# EAGLE design agouti (EAGLE 6.3)
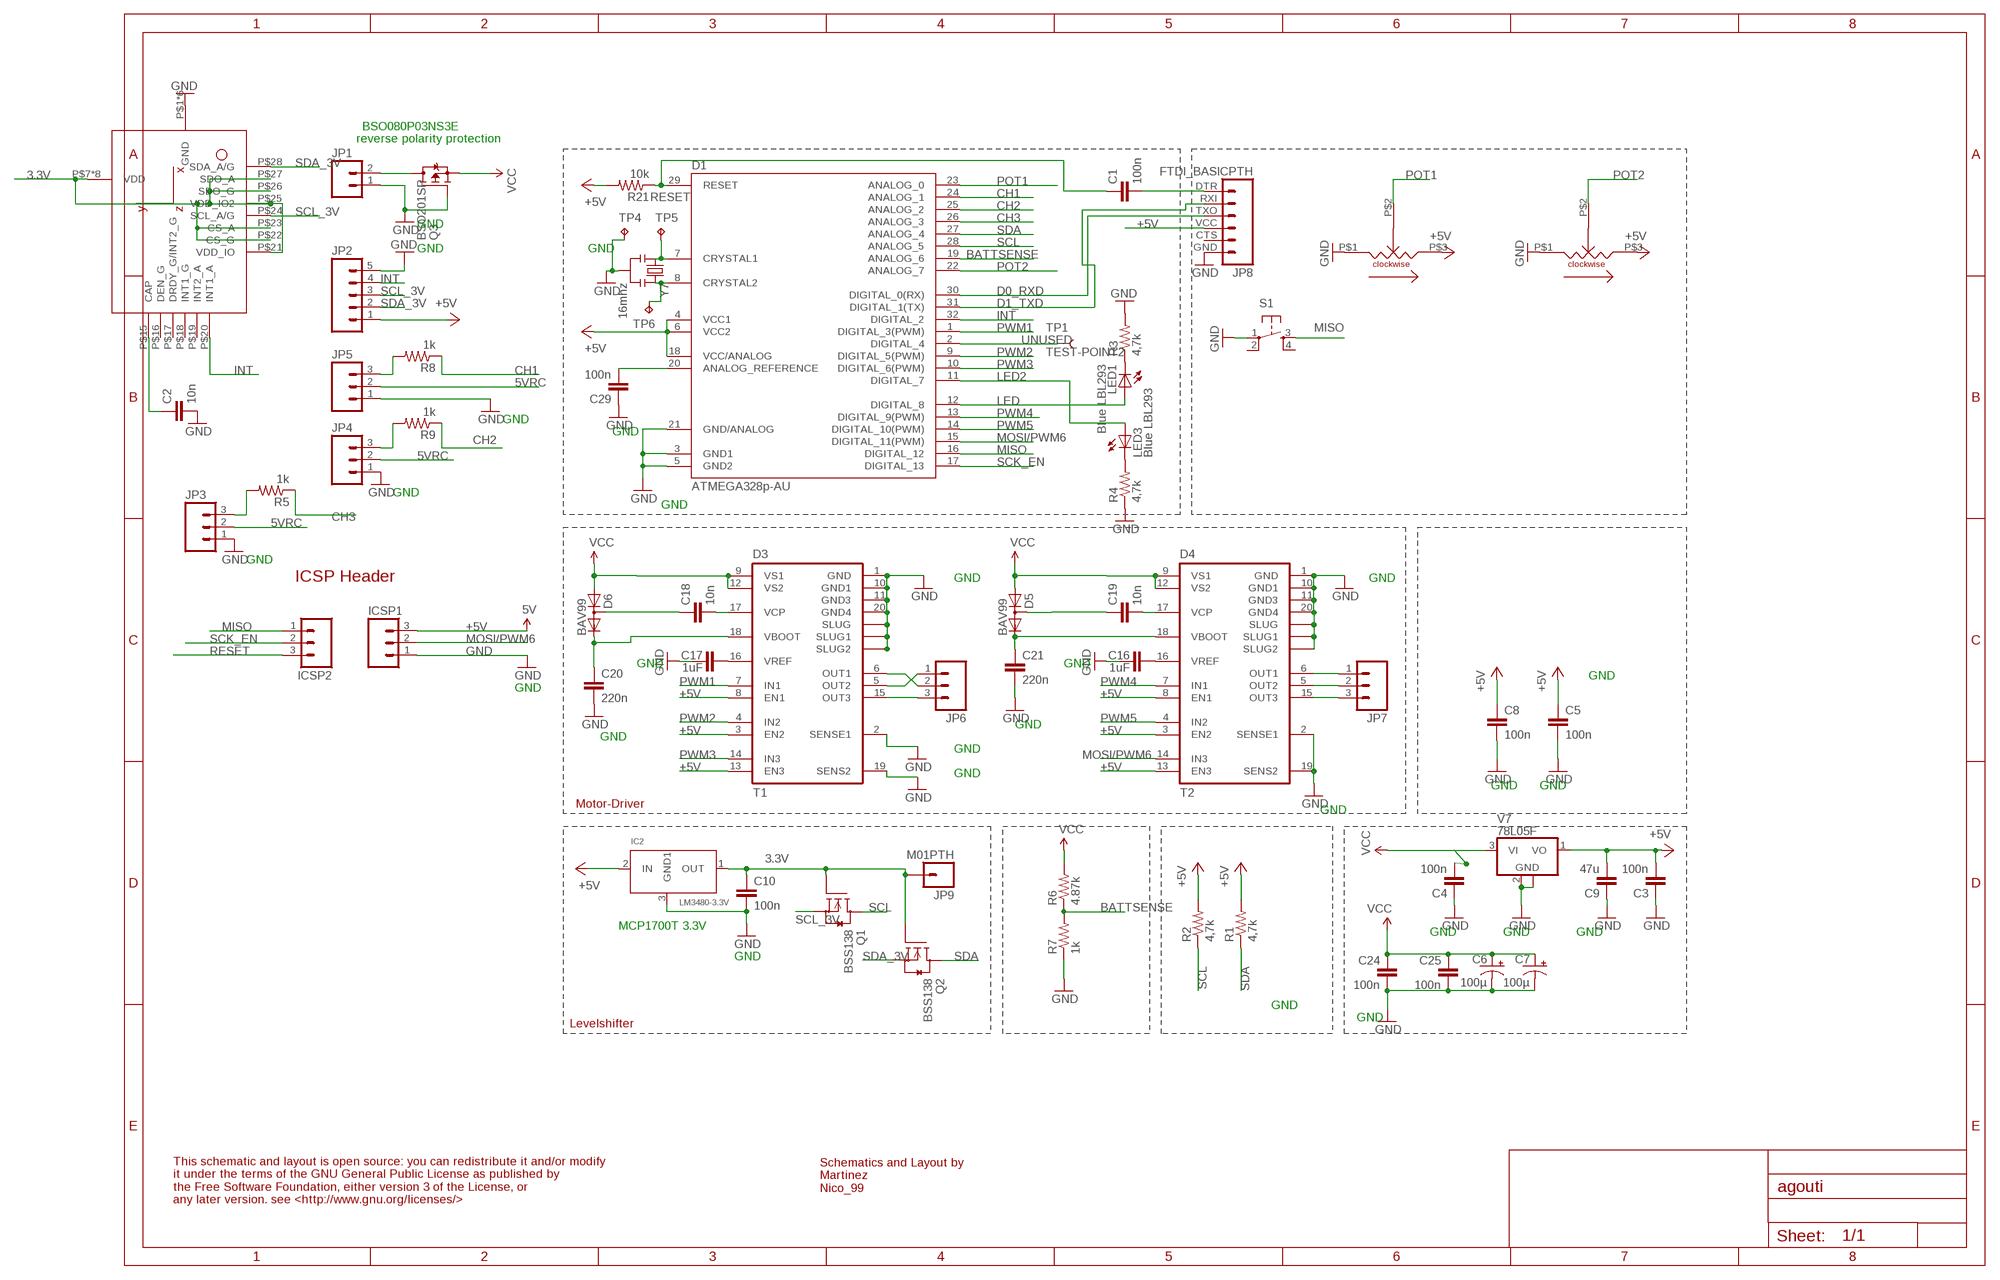
[diagram p0: schematic, sheet 1]

## Parts
C1  100n  CAP0805  [0805]
C2  10n  CAP0805  [0805]
C3  100n  CAP0805  [0805]
C4  100n  CAP0805  [0805]
C5  100n  CAP0805  [0805]
C6  100µ  CAP_POLD  [PANASONIC_D]
C7  100µ  CAP_POLD  [PANASONIC_D]
C8  100n  CAP0805  [0805]
C9  47u  C-EUC1210  [C1210]
C10  100n  CAP0805  [0805]
C16  1uF  CAP0805  [0805]
C17  1uF  CAP0805  [0805]
C18  10n  CAP0805  [0805]
C19  10n  CAP0805  [0805]
C20  220n  CAP0805  [0805]
C21  220n  CAP0805  [0805]
C24  100n  CAP0805  [0805]
C25  100n  CAP0805  [0805]
C29  100n  CAP0805  [0805]
D1  ATMEGA328p-AU  ATMEGA168-AU  [TQFP32-08]
D3  T1  L6234  [SO20POWER2]
D4  T2  L6234  [SO20POWER2]
D5  BAV99  BAV199  [SOT23]
D6  BAV99  BAV199  [SOT23]
IC2  LM3480-3.3V  VREG_MULTI2  [SOT23]
ICSP1  M03PTH  [1X03]
ICSP2  M03PTH  [1X03]
JP1  M02PTH  [1X02]
JP2  M05PTH  [1X05]
JP3  M03PTH  [1X03]
JP4  M03PTH  [1X03]
JP5  M03PTH  [1X03]
JP6  M03PTH  [1X03]
JP7  M03PTH  [1X03]
JP8  FTDI_BASICPTH  [FTDI_BASIC]
JP9  M01PTH  [1X01]
LED1  Blue LBL293  LEDCHIP-LED0603  [CHIP-LED0603]
LED3  Blue LBL293  LEDCHIP-LED0603  [CHIP-LED0603]
Q1  BSS138  [SOT23]
Q2  BSS138  [SOT23]
Q3  BSO201SP  [SO-8]
R1  4,7k  RESISTOR0805-RES  [0805]
R2  4,7k  RESISTOR0805-RES  [0805]
R3  4,7k  RESISTOR0805-RES  [0805]
R4  4,7k  RESISTOR0805-RES  [0805]
R5  1k  RESISTOR0805-RES  [0805]
R6  4.87k  RESISTOR0805-RES  [0805]
R7  1k  RESISTOR0805-RES  [0805]
R8  1k  RESISTOR0805-RES  [0805]
R9  1k  RESISTOR0805-RES  [0805]
R21  10k  RESISTOR0805-RES  [0805]
S1  TAC_SWITCHSMD  [TACTILE_SWITCH_SMD]
TP1  TEST-POINT2  [PAD.02X.02]
TP4  TPTP06SQ  [TP06SQ]
TP5  TPTP06SQ  [TP06SQ]
TP6  TPTP06SQ  [TP06SQ]
U$3  TRIMMERPOT  [BOURNES_3361P]
U$5  TRIMMERPOT  [BOURNES_3361P]
U$6  LSM330  [LGA-28]
V7  78L05F  [SOT89]
Y7  16mhz  RESONATORSMD  [RESONATOR-SMD]

## Nets
3.3V: C10.1 IC2.1(OUT) JP9.1 Q1.1(G) Q2.1(G) U$6.P$7(VDD) U$6.P$8(VDD) U$6.P$9(VDD) U$6.P$10(VDD) U$6.P$11(VDD) U$6.P$12(VDD) U$6.P$13(VDD) U$6.P$14(VDD) U$6.P$21(VDD_IO) U$6.P$22(CS_G) U$6.P$23(CS_A) U$6.P$25(VDD_IO2) U$6.P$26(SDO_G) U$6.P$27(SDO_A)
5VRC: JP3.2 JP4.2 JP5.2
+5V: C3.2 C5.1 C8.1 C9.2 D1.4(VCC1) D1.6(VCC2) D1.18(VCC/ANALOG) D3.3(EN2) D3.8(EN1) D3.13(EN3) D4.3(EN2) D4.8(EN1) D4.13(EN3) IC2.2(IN) ICSP1.3 JP2.1 JP8.VCC R1.2 R2.2 R21.2 U$3.P$3 U$5.P$3 V7.1(VO) ; supply symbol labelled 5V
BATTSENSE: D1.19(ANALOG_6) R6.1 R7.2
CH1: D1.24(ANALOG_1) R8.1
CH2: D1.25(ANALOG_2) R9.1
CH3: D1.26(ANALOG_3) R5.1
D0_RXD: D1.30(DIGITAL_0(RX)) JP8.TXO
D1_TXD: D1.31(DIGITAL_1(TX)) JP8.RXI
GND: C2.2 C3.1 C4.1 C5.2 C6.- C7.- C8.2 C9.1 C10.2 C16.1 C17.1 C20.2 C21.2 C24.2 C25.2 C29.1 D1.3(GND1) D1.5(GND2) D1.21(GND/ANALOG) D3.1(GND) D3.2(SENSE1) D3.10(GND1) D3.11(GND3) D3.19(SENS2) D3.20(GND4) D3.SLUG1(SLUG2) D3.SLUG2(SLUG) D3.SLUG(SLUG1) D4.1(GND) D4.2(SENSE1) D4.10(GND1) D4.11(GND3) D4.19(SENS2) D4.20(GND4) D4.SLUG1(SLUG2) D4.SLUG2(SLUG) D4.SLUG(SLUG1) IC2.3(GND1) ICSP1.1 JP1.1 JP2.5 JP3.1 JP4.1 JP5.1 JP8.GND Q3.4(G) R3.2 R4.1 R7.1 S1.1 TP4.TP U$3.P$1 U$5.P$1 U$6.P$1(GND) U$6.P$2(GND) U$6.P$3(GND) U$6.P$4(GND) U$6.P$5(GND) U$6.P$6(GND) V7.2(GND) V7.2@1(GND) Y7.2
INT: D1.32(DIGITAL_2) JP2.4 U$6.P$20(INT1_A)
LED: D1.12(DIGITAL_8) LED1.A
LED2: D1.11(DIGITAL_7) LED3.A
MISO: D1.16(DIGITAL_12) ICSP2.1 S1.3
MOSI/PWM6: D1.15(DIGITAL_11(PWM)) D4.14(IN3) ICSP1.2
N$1: LED1.C R3.1
N$2: LED3.C R4.2
N$3: JP1.2 Q3.5(D) Q3.6(D) Q3.7(D) Q3.8(D)
N$4: JP3.3 R5.2
N$5: JP5.3 R8.2
N$6: JP4.3 R9.2
N$7: C16.2 D4.16(VREF)
N$8: C17.2 D3.16(VREF)
N$9: C1.2 JP8.DTR
N$11: C2.1 U$6.P$15(CAP)
N$17: C18.2 D3.17(VCP)
N$18: C19.2 D4.17(VCP)
N$19: C19.1 D5.3(AC)
N$20: C21.1 D4.18(VBOOT) D5.2(C)
N$21: D3.15(OUT3) JP6.3
N$23: D4.6(OUT1) JP7.1
N$24: D4.5(OUT2) JP7.2
N$25: D4.15(OUT3) JP7.3
N$27: D3.5(OUT2) JP6.1
N$28: D3.6(OUT1) JP6.2
N$38: D1.8(CRYSTAL2) TP6.TP Y7.3
N$39: D1.7(CRYSTAL1) TP5.TP Y7.1
N$40: C29.2 D1.20(ANALOG_REFERENCE)
POT1: D1.23(ANALOG_0) U$3.P$2
POT2: D1.22(ANALOG_7) U$5.P$2
PWM1: D1.1(DIGITAL_3(PWM)) D3.7(IN1)
PWM2: D1.9(DIGITAL_5(PWM)) D3.4(IN2)
PWM3: D1.10(DIGITAL_6(PWM)) D3.14(IN3)
PWM4: D1.13(DIGITAL_9(PWM)) D4.7(IN1)
PWM5: D1.14(DIGITAL_10(PWM)) D4.4(IN2)
RESET: C1.1 D1.29(RESET) ICSP2.3 R21.1
SCK_EN: D1.17(DIGITAL_13) ICSP2.2
SCL: D1.28(ANALOG_5) Q1.3(D) R2.1
SCL_3V: JP2.3 Q1.2(S) U$6.P$24(SCL_A/G)
SDA: D1.27(ANALOG_4) Q2.3(D) R1.1
SDA_3V: JP2.2 Q2.2(S) U$6.P$28(SDA_A/G)
UNUSED: D1.2(DIGITAL_4) TP1.P$1
VBOOT1: C20.1 D3.18(VBOOT) D6.2(C)
VCC: C4.2 C6.+ C7.+ C24.1 C25.1 D3.9(VS1) D3.12(VS2) D4.9(VS1) D4.12(VS2) D5.1(A) D6.1(A) Q3.1(S) Q3.2(S) Q3.3(S) R6.2 V7.3(VI)
VCP1: C18.1 D6.3(AC)
Unconnected: JP8.CTS S1.2 S1.4 U$6.P$16(DEN_G) U$6.P$17(DRDY_G/INT2_G) U$6.P$18(INT1_G) U$6.P$19(INT2_A)

## Notes on the sheet
- FTDI
- BSO080P03NS3E
- reverse polarity protection
- GND
- GND | GND
- GND
- GND
- GND
- GND
- GND
- ICSP Header | GND | GND
- GND | GND
- GND
- GND
- GND
- GND
- GND
- GND
- GND | GND
- Motor-Driver
- GND
- MCP1700T 3.3V
- GND | GND | GND
- GND
- GND
- GND
- Levelshifter
- Schematics and Layout by
  Martinez
  Nico_99
- This schematic and layout is open source: you can redistribute it and/or modify
  it under the terms of the GNU General Public License as published by
  the Free Software Foundation, either version 3 of the License, or
  any later version. see <http://www.gnu.org/licenses/>

## Library data of the parts
C1-C5 C8 C10 C16-C21 C24 C25 C29 = SparkFun:CAP: Capacitor Standard 0603 ceramic capacitor, and 0.1" leaded capacitor.
C6 C7 = SparkFun:CAP_POL: Capacitor Polarized These are standard SMD and PTH capacitors. Normally 10uF, 47uF, and 100uF in electrolytic and tantalum varieties. Always verify the external diameter of the through hole cap, it varies with capacity, voltage, and manufacturer. The EIA devices should be standard.
C9 = rcl:C-EU: CAPACITOR, European symbol
D1 = Arduino-AVR:ATMEGA168
D3 D4 = L6234:L6234
D5 D6 = diode:BAV199: DIODE low-leakage double diode
IC2 = m-pad-2.1_my:VREG_MULTI2: standard package voltage regulator (LM3480, etc)
ICSP1 ICSP2 JP3-JP5 = SparkFun-Connectors:M03: Header 3 Standard 3-pin 0.1" header. Use with straight break away headers (SKU : PRT-00116), right angle break away headers (PRT-00553), swiss pins (PRT-00743), machine pins (PRT-00117), and female headers (PRT-00115). Molex polarized connector foot print use with SKU : PRT-08232 with associated crimp pins and housings.
JP1 = SparkFun:M02: Header 2 Standard 2-pin 0.1" header. Use with straight break away headers (SKU : PRT-00116), right angle break away headers (PRT-00553), swiss pins (PRT-00743), machine pins (PRT-00117), and female headers (PRT-00115). Molex polarized connector foot print use with SKU : PRT-08233 with associated crimp pins and housings.
JP2 = SparkFun:M05: Header 5 Standard 5-pin 0.1" header. Use with straight break away headers (SKU : PRT-00116), right angle break away headers (PRT-00553), swiss pins (PRT-00743), machine pins (PRT-00117), and female headers (PRT-00115). Molex polarized connector foot print use with SKU : PRT-08230 with associated crimp pins and housings.
JP6 JP7 = SparkFun:M03: Header 3 Standard 3-pin 0.1" header. Use with straight break away headers (SKU : PRT-00116), right angle break away headers (PRT-00553), swiss pins (PRT-00743), machine pins (PRT-00117), and female headers (PRT-00115). Molex polarized connector foot print use with SKU : PRT-08232 with associated crimp pins and housings.
JP8 = SparkFun-Connectors:FTDI_BASIC: FTDI Basic header with labels
JP9 = SparkFun-Connectors:M01: Header 1 Standard 1-pin 0.1" header. Use with straight break away headers (SKU : PRT-00116), right angle break away headers (PRT-00553), swiss pins (PRT-00743), machine pins (PRT-00117), and female headers (PRT-00115).
LED1 LED3 = led:LED: LED OSRAM: - CHIPLED LG R971, LG N971, LY N971, LG Q971, LY Q971, LO R971, LY R971 LH N974, LH R974 LS Q976, LO Q976, LY Q976 LO Q996 - Hyper CHIPLED LW Q18S LB Q993, LB Q99A, LB R99A - SideLED LS A670, LO A670, LY A670, LG A670, LP A670 LB A673, LV A673, LT A673, LW A673 LH A674 LY A675 LS A676, LA A676, LO A676, LY A676, LW A676 LS A679, LY A679, LG A679 - Hyper Micro SIDELED® LS Y876, LA Y876, LO Y876, LY Y876 LT Y87S - SmartLED LW L88C, LW L88S LB L89C, LB L89S, LG L890 LS L89K, LO L89K, LY L89K LS L896, LA L896, LO L896, LY L896 - TOPLED LS T670, LO T670, LY T670, LG T670, LP T670 LSG T670, LSP T670, LSY T670, LOP T670, LYG T670 LG T671, LOG T671, LSG T671 LB T673, LV T673, LT T673, LW T673 LH T674 LS T676, LA T676, LO T676, LY T676, LB T676, LH T676, LSB T676, LW T676 LB T67C, LV T67C, LT T67C, LS T67K, LO T67K, LY T67K, LW E67C LS E67B, LA E67B, LO E67B, LY E67B, LB E67C, LV E67C, LT E67C LW T67C LS T679, LY T679, LG T679 LS T770, LO T770, LY T770, LG T770, LP T770 LB T773, LV T773, LT T773, LW T773 LH T774 LS E675, LA E675, LY E675, LS T675 LS T776, LA T776, LO T776, LY T776, LB T776 LHGB T686 LT T68C, LB T68C - Hyper Mini TOPLED® LB M676 - Mini TOPLED Santana® LG M470 LS M47K, LO M47K, LY M47K Source: http://www.osram.convergy.de LUXEON: - LUMILED® LXK2-PW12-R00, LXK2-PW12-S00, LXK2-PW14-U00, LXK2-PW14-V00 LXK2-PM12-R00, LXK2-PM12-S00, LXK2-PM14-U00 LXK2-PE12-Q00, LXK2-PE12-R00, LXK2-PE12-S00, LXK2-PE14-T00, LXK2-PE14-U00 LXK2-PB12-K00, LXK2-PB12-L00, LXK2-PB12-M00, LXK2-PB14-N00, LXK2-PB14-P00, LXK2-PB14-Q00 LXK2-PR12-L00, LXK2-PR12-M00, LXK2-PR14-Q00, LXK2-PR14-R00 LXK2-PD12-Q00, LXK2-PD12-R00, LXK2-PD12-S00 LXK2-PH12-R00, LXK2-PH12-S00 LXK2-PL12-P00, LXK2-PL12-Q00, LXK2-PL12-R00 Source: www.luxeon.com KINGBRIGHT: KA-3528ASYC Source: www.kingbright.com
Q1 Q2 = m-pad-2.1_my:BSS138: Fairchild Semiconductors BSS138 N-Channel Logic Level Enhancement Mode Field Effect Transistor General Description: These N-Channel enhancement mode field effect transistors are produced using Fairchild's proprietary, high cell density, DMOS technology. These products have been designed to minimize on-state resistance while provide rugged, reliable, and fast switching performance.These products are particularly suited for low voltage, low current applications such as small servo motor control, power MOSFET gate drivers, and other switching applications. Features: 0.22 A, 50 V. RDS(ON) = 3.5Ohm @ VGS = 10 V RDS(ON) = 6.0Ohm @ VGS = 4.5 V High density cell design for extremely low RDS(ON) Rugged and Reliable Compact industry standard SOT-23 surface mount package Please send any comments to: messi@users.sourceforge.net
Q3 = transistor-fet:BSO201SP: OptiMOS(R)-P Small-Signal-Transistor P-Channel, Enhancement mode, Super Logic Level (2.5 V rated) RDS(on) 8mOhm, ID -14.9 a Source: http://www.infineon.com/upload/Document/cmc_upload/documents/011/3655/BSO201SP_211201.pdf
R1-R9 R21 = SparkFun:RESISTOR: Resistor Basic schematic elements and footprints for 0603, 1206, and PTH resistors.
S1 = SparkFun-Electromechanical:TAC_SWITCH: Momentary Switch Button commonly used for reset or general input. Spark Fun Electronics SKU : COM-00097 SMT- SWCH-08247; PROD_ID: SWCH-08247
TP1 = SparkFun-Passives:TEST-POINT: Bare copper test points for troubleshooting or ICT
TP4-TP6 = testpad:TP: Test pad
U$3 U$5 = _diversity:TRIMMERPOT
U$6 = _diversity:LSM330
V7 = linear:78L*: POSITOIV-VOLTAGE REGULATORS Output up to 100 mA Source: http://focus.ti.com/lit/ds/symlink/ua78l05.pdf
Y7 = SparkFun:RESONATOR: Resonator Small SMD resonator. This is the itty bitty 10/20MHz resonators with built in caps. CSTCE10M0G55 and CSTCE20M0V53. Footprint has been reviewed closely but hasn't been tested yet.

## Net classes
0 default: width 0.152 mm, clearance 0.152 mm

## Board
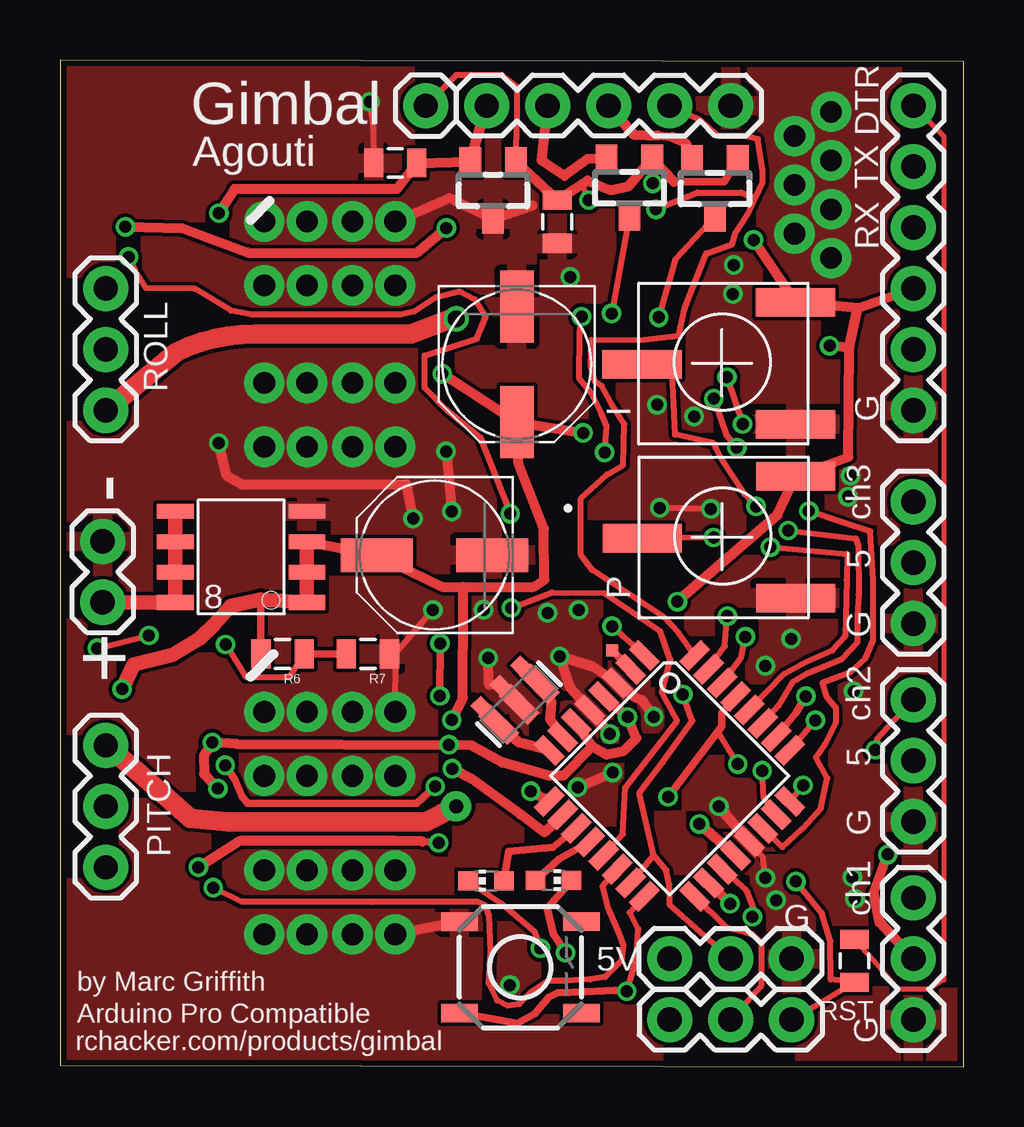
[diagram p1: board, top side]
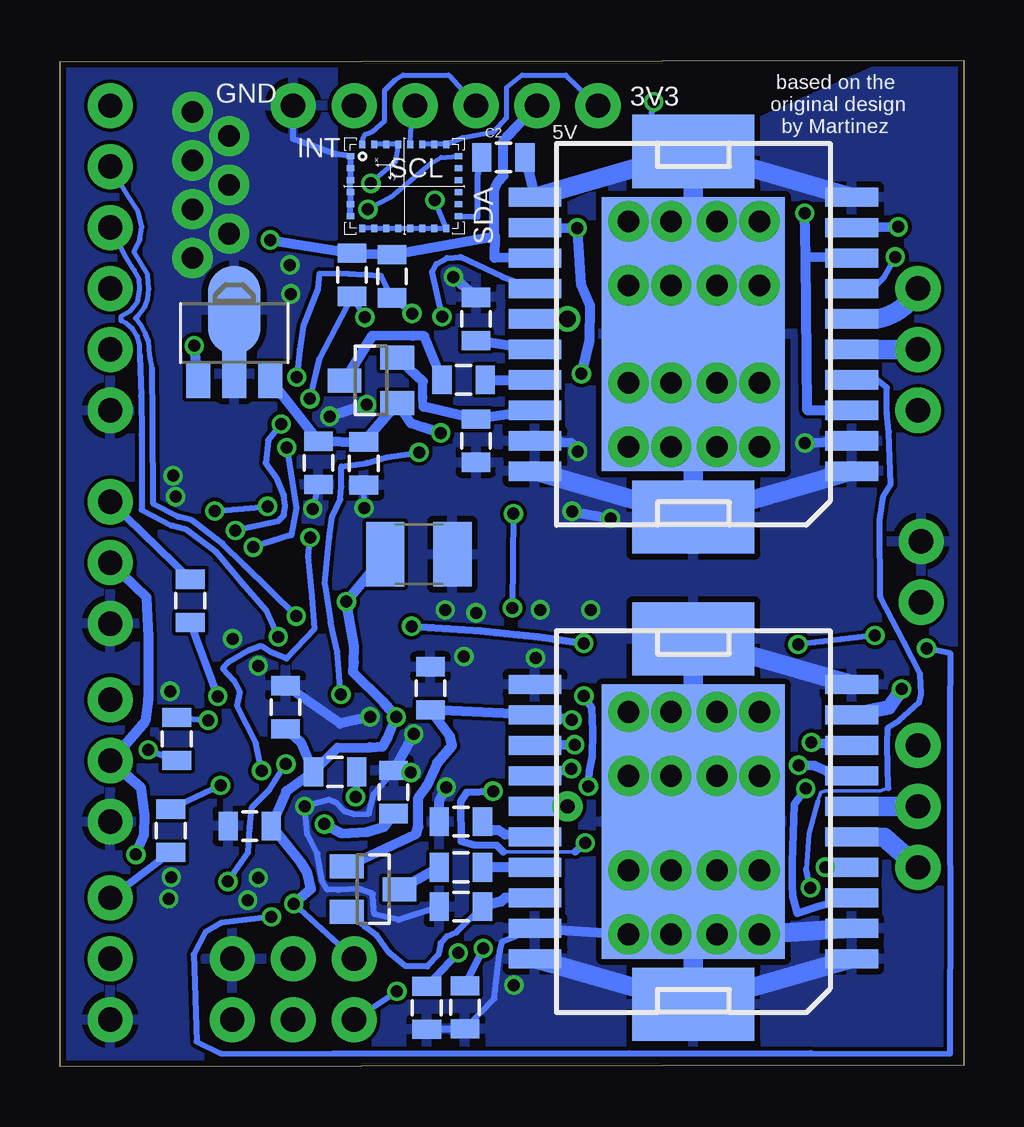
[diagram p2: board, bottom side, seen from below]

Size 37.66 x 41.97 mm. Coordinates in mm from the lower left corner, seen from the top.
Outline: 0,0.06 37.66,0 37.66,41.91 0,41.97 0,0.06
Copper layers (1*16): Top 0.035mm / dielectric 1.5mm / Bottom 0.035mm
Design rules "ITEADstudio_DRC": minimum track width 6mil, minimum drill 12mil, track to track 6mil, track to pad 6mil, pad to pad 6mil, via to via 6mil, smd to smd 0mil, copper to edge 10mil, drill to drill 10mil, minimum pad ring 10mil, minimum via ring 6mil, stop-mask expansion 2mil, vias tented up to drill 100mil, thermal gap 10mil

### Footprints (pad centres in the part's own frame; a part is rotated, then mirrored left to right if it is on the bottom)
0805 = smd 0.8 x 1.2: 1 -0.9,0; 2 0.9,0
PANASONIC_D = smd 3 x 1.4: + 2.4,0; - -2.4,0
C1210 = smd 1.6 x 2.7: 1 -1.4,0; 2 1.4,0
TQFP32-08 = smd 1.27 x 0.559: 1 -4.293,2.8; 2 -4.293,2; 3 -4.293,1.2; 4 -4.293,0.4; 5 -4.293,-0.4; 6 -4.293,-1.2; 7 -4.293,-2; 8 -4.293,-2.8; 17 4.293,-2.8; 18 4.293,-2; 19 4.293,-1.2; 20 4.293,-0.4; 21 4.293,0.4; 22 4.293,1.2; 23 4.293,2; 24 4.293,2.8 | smd 0.559 x 1.27: 9 -2.8,-4.293; 10 -2,-4.293; 11 -1.2,-4.293; 12 -0.4,-4.293; 13 0.4,-4.293; 14 1.2,-4.293; 15 2,-4.293; 16 2.8,-4.293; 25 2.8,4.293; 26 2,4.293; 27 1.2,4.293; 28 0.4,4.293; 29 -0.4,4.293; 30 -1.2,4.293; 31 -2,4.293; 32 -2.8,4.293
SO20POWER2 = smd 0.8 x 2.2: 1 -5.715,-6.6; 2 -4.445,-6.6; 3 -3.175,-6.6; 4 -1.905,-6.6; 5 -0.635,-6.6; 6 0.635,-6.6; 7 1.905,-6.6; 8 3.175,-6.6; 9 4.445,-6.6; 10 5.715,-6.6; 11 5.715,6.6; 12 4.445,6.6; 13 3.175,6.6; 14 1.905,6.6; 15 0.635,6.6; 16 -0.635,6.6; 17 -1.905,6.6; 18 -3.175,6.6; 19 -4.445,6.6; 20 -5.715,6.6 | smd 3.048 x 5.08: SLUG -7.62,0; SLUG2 7.62,0 | smd 11.43 x 7.62: SLUG1 0,0
SOT23 = smd 1 x 1.4: 1 -0.95,-1.1; 2 0.95,-1.1; 3 0,1.1
SOT23' = smd 0.9 x 1.2: 1 -0.95,-1.2; 2 0.95,-1.2; 3 0,1.2
1X03 = drill 1.016 pad 1.88: 1 0,0; 2 2.54,0; 3 5.08,0
1X02 = drill 1.016 pad 1.88: 1 0,0; 2 2.54,0
1X05 = drill 1.016 pad 1.88: 1 0,0; 2 2.54,0; 3 5.08,0; 4 7.62,0; 5 10.16,0
FTDI_BASIC = drill 1.016 pad 1.88: CTS 10.16,0; DTR 0,0; GND 12.7,0; RXI 2.54,0; TXO 5.08,0; VCC 7.62,0
1X01 = drill 1.016 pad 1.88: 1 0,0
CHIP-LED0603 = smd 0.8 x 0.8: A 0,-0.75; C 0,0.75
SO-8 = smd 1.524 x 0.61: 1 -2.743,1.905; 2 -2.743,0.635; 3 -2.743,-0.635; 4 -2.743,-1.905; 5 2.743,-1.905; 6 2.743,-0.635; 7 2.743,0.635; 8 2.743,1.905
TACTILE_SWITCH_SMD = smd 1.524 x 0.762: 1 -2.54,1.905; 2 2.54,1.905; 3 -2.54,-1.905; 4 2.54,-1.905
PAD.02X.02 = smd 0.508 x 0.508: P$1 0,0
TP06SQ = smd 0.6 x 0.6: TP 0,0
BOURNES_3361P = smd 1.19 x 3.3: P$1 -2.54,1.678; P$2 -0.04,8.078; P$3 2.54,1.678
LGA-28 = smd 0.325 x 0.25: P$1 -2.25,1.25; P$2 -2.25,0.75; P$3 -2.25,0.25; P$4 -2.25,-0.25; P$5 -2.25,-0.75; P$6 -2.25,-1.25; P$15 2.25,-1.25; P$16 2.25,-0.75; P$17 2.25,-0.25; P$18 2.25,0.25; P$19 2.25,0.75; P$20 2.25,1.25 | smd 0.25 x 0.325: P$7 -1.75,-1.75; P$8 -1.25,-1.75; P$9 -0.75,-1.75; P$10 -0.25,-1.75; P$11 0.25,-1.75; P$12 0.75,-1.75; P$13 1.25,-1.75; P$14 1.75,-1.75; P$21 1.75,1.75; P$22 1.25,1.75; P$23 0.75,1.75; P$24 0.25,1.75; P$25 -0.25,1.75; P$26 -0.75,1.75; P$27 -1.25,1.75; P$28 -1.75,1.75
SOT89 = smd 1 x 1.5: 1 -1.499,-1.981; 3 1.499,-1.981 | smd 1 x 2: 2 0,-1.727 | smd 2.2 x 3.7: 2@1 0,0.94
RESONATOR-SMD = smd 0.7 x 1.7: 1 -1.2,0; 2 0,0; 3 1.2,0

### Placement (x,y rotation side)
C1  33.1,4.42 90 top
C2  19.18,37.91 0 bottom
C3  13.97,37.68 0 top
C4  26.88,25.18 90 bottom
C5  28.26,14.99 90 bottom
C6  19.03,29.29 270 top
C7  15.6,21.34 180 top
C8  29.75,10.04 180 bottom
C9  22.7,21.37 180 bottom
C10  20.72,35.23 270 top
C16  20.32,31.18 270 bottom
C17  20.95,10.22 0 bottom
C18  20.95,8.32 0 bottom
C19  20.84,28.64 0 bottom
C20  20.95,6.68 180 bottom
C21  20.32,26.1 270 bottom
C24  24.99,25.16 270 bottom
C25  22.22,15.78 90 bottom
C29  23.76,11.46 270 bottom
D1  25.4,12.13 315 top
D3  11.27,10.22 90 bottom
D4  11.27,30.54 90 bottom
D5  24.7,28.61 90 bottom
D6  24.61,7.41 270 bottom
IC2  LM3480-3.3V  [SOT23']  18.04,36.54 180 top
ICSP1  30.48,4.51 180 top
ICSP2  25.4,1.97 0 top
JP1  1.78,21.91 270 top
JP2  17.78,40.07 0 top
JP3  35.56,18.48 90 top
JP4  35.56,10.22 90 top
JP5  35.56,1.97 90 top
JP6  1.91,8.32 90 top
JP7  1.91,32.45 270 top
JP8  35.56,40.07 270 top
JP9  15.24,40.07 0 top
LED1  20.57,7.78 270 top
LED3  17.75,7.76 90 top
Q1  BSS138  [SOT23']  27.29,36.61 180 top
Q2  BSS138  [SOT23']  23.73,36.65 180 top
Q3  7.55,21.26 180 top
R1  23.82,32.96 90 bottom
R2  25.49,33.02 90 bottom
R3  22.37,2.47 270 bottom
R4  20.78,2.48 90 bottom
R5  32.22,19.43 90 bottom
R6  9.27,17.21 180 top
R7  12.83,17.21 180 top
R8  33.05,9.85 270 bottom
R9  32.8,13.67 270 bottom
R21  26.19,12.29 180 bottom
S1  19.18,4.15 0 top
TP1  23,17.36 0 top
TP4  18.32,15.92 45 top
TP5  19.19,16.73 45 top
TP6  17.53,15.04 45 top
U$2  [RCHACKERLOGOBMP]  0.43,36.72 0 top
U$3  32.34,22.08 90 top
U$5  32.33,29.33 90 top
U$6  23.3,36.7 0 bottom
V7  30.4,30.6 0 bottom
Y7  19.13,15.11 225 top

### Tracks (layer width: path | path; a pad name or v marks a point on that pad's centre or on a via)
3.3V  (via drill 0.5)
  Top 0.203: v24.7,36.83 Q2.1 | v22.03,36.13 21.76,36.8
  Top 0.254: IC2.1 19.05,39.56 19.05,40.83 18.41,41.34 16.51,41.34 JP9.1
  Top 0.305: 25.58,36.89 27.67,36.9 Q1.1
  Top 0.406: IC2.1 C10.1 21.76,36.8 21.97,36.95 22.92,36.56 23.7,36.72 Q2.1 25.58,36.89
  Bottom 0.203: U$6.P$7 U$6.P$8 U$6.P$9 U$6.P$10 U$6.P$11 U$6.P$12 U$6.P$13 U$6.P$14 v22.03,36.13 | v24.7,36.83 23.68,37.72 U$6.P$25 U$6.P$26 U$6.P$27 | JP9.1 16.57,41.34 18.41,41.34 19.05,40.83 19.05,39.56 19.56,38.99 20.89,38.74 U$6.P$21 U$6.P$22 U$6.P$23
5VRC  (via drill 0.5)
  Top 0.406: JP5.2 34.15,6.02 33.9,7.25 v34.49,8.85
  Bottom 0.406: v34.49,8.85 34.15,9.68 34.13,10.5 34.28,11.63 JP4.2 34.97,13.38 34.11,14.4 33.98,15.35 33.97,17.9 34.06,19.58 JP3.2
+5V  (via drill 0.5, 0.5 pad 0.25)
  Top 0.406: v6.62,35.58 7.27,36.6 14.04,36.6 C3.2 IC2.2 JP2.1 | D1.18 27.76,6.97 27.83,6.88 v27.92,6.81 | v6.58,11.6 6,12.21 5.99,12.97 v6.34,13.53 7.38,13.46 v16.2,13.43 17.14,13.41 18.42,12.69 20.41,12.13 20.96,12.13 22.19,13.36 | 22.19,13.36 D1.6 | D1.4 v23.65,14.58 24.01,13.69 23.49,13.18 22.77,13.02 22.19,13.36 | v25.72,19.39 29.89,23 U$3.P$3 32.85,25.43 32.89,30.01 | 32.89,30.01 33.24,31.63 | 33.24,31.63 JP8.VCC | 33.24,31.63 U$5.P$3 v28.9,34.47 | v32.06,30.06 32.89,30.01
  Bottom 0.254: v27.92,6.81 ICSP1.3
  Bottom 0.305: D3.3 6.05,6.7 6.93,6.41 7.12,7.12 7.14,7.63 7.14,8.52 7.06,10.94 v6.58,11.6
  Bottom 0.406: D4.3 6.52,27.36 6.59,33.75 | 6.59,33.75 v6.62,35.58 | v16.2,13.43 D3.13 | C5.1 27.62,13.52 R21.2 | R21.2 26.1,13.3 24.74,13.32 24.21,13.36 24.01,13.69 v23.65,14.58 24.19,15.22 25.44,16.44 25.41,16.87 25.4,17.53 v25.72,19.39 C9.2 | R21.2 28.23,11.49 C8.1 27.63,8.55 27.37,8.11 27.21,7.4 v27.92,6.81 | D4.13 19.54,33.73 19.53,34.63 | v6.34,13.53 D3.8 | D4.8 6.59,33.75 | V7.1 v32.06,30.06 | v28.9,34.47 R2.2 R1.2 19.53,34.63 | 19.53,34.63 19.56,34.63 19.56,36.58 19.37,36.94 19.18,37.14 19.18,38.61 19.01,38.81 18.59,39.24 JP2.1
BATTSENSE  (via drill 0.5)
  Top 0.254: D1.19 28.58,7.37 28.9,6.6 v28.85,6.25 | v1.55,17.45 v3.7,17.98 | v6.9,17.61 7.73,16.26 9.58,16.24 R6.1
  Top 0.305: R6.1 R7.2
  Bottom 0.254: v28.85,6.25 30.95,6 31.6,5.61 32.09,4.69 31.96,1.05 30.95,0.55 26.27,0.56 13.92,0.57 6.36,0.57 0.57,0.56 0.55,7.62 0.57,9.18 0.57,14.54 0.55,17.23 v1.55,17.45 | v3.7,17.98 v6.9,17.61
CH1  (via drill 0.5)
  Top 0.254: v30.96,11.74 D1.24
  Bottom 0.254: R8.1 v30.96,11.74
CH2  (via drill 0.5)
  Top 0.254: v31.48,14.45 D1.25
  Bottom 0.254: R9.1 v31.48,14.45
CH3  (via drill 0.5)
  Top 0.305: D1.26 30.67,14.77 v31.08,15.45
  Bottom 0.305: v31.08,15.45 R5.1
D0_RXD  (via drill 0.5)
  Top 0.254: D1.30 28.38,17.07 v28.56,17.93
  Bottom 0.203: 34.32,29.65 34.34,30.11 34.44,30.45 34.63,30.75 34.92,31.01 35.11,31.11 35.1,31.29 34.71,31.53 34.42,31.91 34.33,32.43 34.36,32.83 34.55,33.2 34.92,33.76 JP8.TXO
  Bottom 0.254: v28.56,17.93 29.05,19.02 30.07,20.17 31.15,21.45 32.4,22.41 33.02,22.56 34.26,23.22 34.26,26.35 34.28,27.97 34.32,29.65
D1_TXD  (via drill 0.5)
  Top 0.254: D1.31 27.7,17.54 v27.81,18.79
  Bottom 0.203: JP8.RXI 34.84,36.32 34.4,35.64 34.25,35.02 34.33,34.47 34.58,33.99 34.01,33.03 33.95,32.42 34,32.01 34.12,31.67 34.4,31.32 34.51,31.2 34.27,30.9 34.09,30.58 33.96,30.23 33.92,29.68 33.82,29.13
  Bottom 0.254: v27.81,18.79 29.98,20.92 30.89,21.82 32.17,22.79 32.74,22.94 33.77,23.47 33.79,26.95 33.82,29.13
GND  (via drill 0.5, 0.5 pad 0.25, 0.9 pad 1.68)
  Top 0.254: v12.92,40.23 13.04,39.1 C3.1 | v13.97,14.8 14,17.25 v15.54,19.05 | D1.21 29.25,8.79 v29.39,7.88 | v27.12,23.26 v24.99,23.3
  Top 0.406: 19.68,35.91 IC2.3 16.23,36.23 v13.97,35.24 | v16.09,25.66 v16.32,23.16 | v14.71,22.86 14.44,24.28 7.62,24.26 6.95,24.63 v6.62,26.01 | D1.21 v27.46,10.86 | v22.92,13.87 D1.5 21.27,15.8 v20.82,17.11 C25.2 D1.3 23.94,15.43 24.27,15.28 v24.74,14.6 | S1.1 v13.97,5.52 | v21.56,11.66 v23.03,12.27 | Y7.2 TP4.TP D3.11 v17.84,17.04
  Bottom 0.254: C29.1 24.59,11.37 24.79,10.55 25.42,10.53 25.81,10.66 26.14,11.01 26.47,11.14 v27.46,10.86 27.36,9.7 26.93,8.88 26.72,7.73 26.52,7.39 26.05,7.38 25.2,7.42 24.62,7.2 24.61,6.81 24.55,6.36 23.55,6.13 C20.2 | R4.1 19.56,2.85 19.4,4.3 19.33,4.79 19.23,5.23 D3.19 | v10.29,14.8 v10.29,12.13 v10.29,8.19 | v10.29,35.24 v10.29,32.58 | 12.47,35.32 11.29,35.98 11.33,37.91 C3.1 13.08,39.2 v12.92,40.23 | C4.1 v27.12,23.26 | v24.99,23.3 C24.2 | U$6.P$6 U$6.P$5 U$6.P$4 U$6.P$3 U$6.P$2 U$6.P$1 26.16,38.04 27.94,38.67 JP2.5
  Bottom 0.305: R4.1 R3.2
  Bottom 0.406: D4.19 16.36,26.02 v16.09,25.66 | v16.32,23.16 v14.71,22.86 | v6.62,26.01 D4.2 | v22.92,13.87 C29.1 v23.03,12.27 | v24.74,14.6 25.98,14.31 C5.2 | D3.19 v13.97,5.52 | C17.1 21.84,11.08 v21.56,11.66 | v21.26,32.93 C16.1 | v24.88,27.6 v26.42,27.12 | C2.2 D4.11
  Bottom 0.813: D3.2 v8.51,5.52 | v12.19,35.24 12.47,35.32 | D3.10 D3.SLUG2 D3.SLUG1 D3.SLUG | D3.1 D3.SLUG | D3.20 D3.SLUG | D4.10 D4.SLUG2 | D4.11 D4.SLUG2 | D4.SLUG2 D4.SLUG1 D4.SLUG | D4.SLUG D4.20 | D4.1 D4.SLUG
  other vias: 8.51,35.24 8.51,32.58 12.19,32.58 13.97,32.58 8.51,28.51 10.29,28.51 12.19,28.51 13.97,28.51 8.51,25.84 10.29,25.84 12.19,25.84 13.97,25.84 8.51,14.8 12.19,14.8 8.51,12.13 12.19,12.13 13.97,12.13 8.51,8.19 12.19,8.19 13.97,8.19 10.29,5.52 12.19,5.52 18.74,3.41 33.02,7.91 33.12,7.01 32.13,33.72 30.61,34.73 32.13,35.75 30.61,36.77 32.13,37.78 30.61,38.8 32.13,39.81 30.46,17.85 33.07,15.66 29.83,6.95 29.39,16.72 32.94,24.64 32.84,23.77 28.08,33.43 28.04,32.22 20.32,18.93 21.6,19.05 17.65,19.06
  pour Top: -2.61,-2.11 -2.08,44 37.96,44.13 37.83,-1.75
  pour Bottom: -1.27,-1.52 38.16,-1.52 38.16,44.13 26.29,44.13 26.29,34.23 20.19,34.23 -2.41,44.26 -2.41,-1.52
INT  (via drill 0.5)
  Top 0.254: D1.32 25.77,18.09 25.15,18.75 22.18,20.71 21.7,21.34 21.7,23.7 22.79,24.69 23.47,25.09 23.51,26.79 22.94,27.7 22.57,28.37 22.28,28.57 22.12,29.26 22.15,30.32 24.13,30.29 25.78,30.48 26.04,31.62 26.92,33.91 28,34.29 28.13,34.73 28.63,35.51 28.97,36.24 | 28.97,36.24 29.27,36.89 29.27,37.34 29.08,38.67 28.57,38.8 27.43,38.8 26.61,39.5 JP2.4 | v24.83,35.75 26.54,36.45 28.38,36.45 28.97,36.24
  Bottom 0.203: v24.83,35.75 23.88,36.26 22.22,37.66 21.78,37.91 U$6.P$20
LED
  Top 0.305: D1.12 20.8,8.67 LED1.A
LED2
  Top 0.305: D1.11 20.52,9.16 18.69,8.98 LED3.A
MISO  (via drill 0.5)
  Top 0.254: v23.62,3.15 24,4.46 24.1,5.74 23.73,6.44 D1.16
  Top 0.305: v23.62,3.15 23.11,3.2 21.88,3.14 20.74,3.1 20.36,2.9 19.79,2.21 19.06,1.81 S1.3
  Bottom 0.254: ICSP2.1 v23.62,3.15
MOSI/PWM6  (via drill 0.5, 0.5 pad 0.25)
  Top 0.254: D1.15 24.74,8.82 | 24.74,8.82 24.14,11.43 25.12,12.7 26.35,14.43 v25.95,15.52 | ICSP1.2 25.4,6.76 25.39,7.59 25.26,8.2 24.74,8.82 | v22.69,25.62 22.78,26.71 22.54,27.26 22.16,28.07 21.64,28.69 21.65,30.6 v21.74,31.28
  Bottom 0.254: v25.95,15.52 26.09,17.31 26.37,18.51 26.62,20.13 26.43,22.07 26.31,22.96 25.98,23.66 25.94,24.19 25.93,25.03 24.86,25.18 24.01,25.41 v22.69,25.62 | v21.74,31.28 22.15,33.13 21.97,33.46 21.53,33.72 20.97,33.76 19.22,32.94 D4.14
N$1  (via drill 0.5)
  Top 0.305: LED1.C 20.29,6.62 20.55,5.54 v21.06,4.75
  Bottom 0.305: v21.06,4.75 R3.1
N$2  (via drill 0.5)
  Top 0.254: LED3.C 17.95,7.1 18.39,6.81 19.76,5.64 v20.02,4.94
  Bottom 0.305: v20.02,4.94 R4.2
N$3
  Top 0.61: JP1.2 Q3.8 Q3.7 Q3.6 Q3.5
N$4
  Bottom 0.305: R5.2 JP3.3
N$5
  Bottom 0.305: R8.2 JP5.3
N$6  (via drill 0.5)
  Top 0.254: JP4.3 34.03,13.66 v33.98,13.21
  Bottom 0.254: v33.98,13.21 R9.2
N$7
  Bottom 0.406: D4.16 C16.2
N$8
  Bottom 0.406: D3.16 19.11,9.69 19.38,9.86 19.69,9.86 C17.2
N$9
  Top 0.203: JP8.DTR 36.83,38.8 36.83,3.62 36.2,3.24 34.92,3.24 33.9,4.45 C1.2
N$11
  Bottom 0.254: U$6.P$15 20.26,35.43 20.26,37.15 C2.1
N$17
  Bottom 0.406: D3.17 C18.2
N$18
  Bottom 0.406: C19.2 D4.17
N$19
  Bottom 0.406: C19.1 22.47,30.46 22.95,30.48 24.66,30.47 D5.3
N$20
  Bottom 0.381: 22.51,27.52 22.54,27.9 22.53,28.58
  Bottom 0.406: D4.18 C21.1 22.51,27.52 | 22.53,28.58 D5.2
N$21  (via drill 0.6 pad 1.27)
  Top 0.813: v16.51,10.86 15.24,10.22 6.99,10.22 5.42,10.37 3.34,12.22 JP6.3
  Bottom 0.813: v16.51,10.86 D3.15
N$23
  Bottom 0.813: JP7.1 arc60 3.76,31.18 D4.6
N$24
  Bottom 0.813: JP7.2 D4.5
N$25  (via drill 0.7)
  Top 0.813: JP7.3 4.83,29.78 arc-27 8.13,30.54 14.61,30.54 16.26,31.18 v16.51,31.18
  Bottom 0.813: v16.51,31.18 D4.15
N$27
  Bottom 0.813: JP6.1 3.31,9.57 D3.5
N$28
  Bottom 0.813: JP6.2 D3.6
N$38
  Top 0.406: D1.8 19.11,13.52 Y7.3 TP6.TP
N$39
  Top 0.406: D1.7 20.42,14.49 20.49,15.2 Y7.1 TP5.TP
N$40  (via drill 0.5 pad 0.25)
  Top 0.406: v26.64,10.12 D1.20
  Bottom 0.406: v26.64,10.12 25.93,9.74 24.87,9.79 24.13,10.02 C29.2
POT1  (via drill 0.5)
  Top 0.254: D1.23 29.31,11.22 v29.26,12.34 | v27.23,22.07 U$3.P$2
  Bottom 0.254: v29.26,12.34 29.5,13.5 30.28,15.05 30.17,15.65 30.41,16.11 30.87,16.61 30.65,16.85 29.79,17.36 29.28,17.55 28.86,17.28 28.22,17.02 27.05,18.27 27.15,19.61 27.3,21.27 v27.23,22.07
POT2  (via drill 0.5)
  Top 0.254: D1.22 30.1,9.16 30.94,9.94 31.7,10.79 31.97,12.03 31.49,12.91 31.86,13.44 32.31,14.34 32.33,14.97 31.94,15.44 31.76,16.01 32.88,16.43 33.57,17.06 33.88,17.78 33.88,20.27 33.77,22.32 32.55,22.72 v31.2,23.17 | v29,23.37 28.53,23.87 27.57,25.35 27.32,25.81 27.23,26 25.63,26.35 25.5,29.35 U$5.P$2
  Bottom 0.254: v31.2,23.17 v29,23.37
PWM1  (via drill 0.5 pad 0.25)
  Top 0.254: v23.01,18.37 23.3,18.1 23.48,17.92 D1.1
  Top 0.305: v6.88,12.57 7.29,11.97 7.59,11.26 7.83,10.97 14.86,10.97 v15.64,11.7 | v15.83,15.46 v15.84,17.65
  Bottom 0.305: v15.64,11.7 15.61,12.31 15.47,12.95 15.46,13.99 15.5,14.95 v15.83,15.46 | v15.84,17.65 17.71,17.93 18.54,18.01 19.54,18.11 20.13,18.16 v23.01,18.37
  Bottom 0.406: D3.7 5.72,12.34 6.23,12.56 v6.88,12.57
PWM2  (via drill 0.5, 0.5 pad 0.25)
  Top 0.305: v15.77,9.33 15.1,9.4
  Top 0.406: D1.9 v19.61,11.49 | 15.1,9.4 13.97,9.43 7.49,9.42 v5.77,8.32
  Bottom 0.152: 19.18,8.95 16.18,8.95
  Bottom 0.305: v19.61,11.49 20.7,11.44 20.95,11.06 20.93,9.41 20.42,9.26 19.46,9.23 19.18,8.95 | 16.18,8.95 v15.77,9.33
  Bottom 0.406: v5.77,8.32 D3.4
PWM3  (via drill 0.5 pad 0.25)
  Top 0.406: D1.10 20.18,9.79 19.2,10.52 17.17,11.99 v16.34,12.43
  Bottom 0.406: v16.34,12.43 D3.14
PWM4  (via drill 0.5, 0.5 pad 0.25)
  Top 0.254: D1.13 23.45,9.71 23.54,11.64 25.72,14.43 25.08,15.6 25.43,16.97 25,18.17 22.67,19.75 20.49,19.78 v18.8,19.13 | v2.86,33.76 3.12,33.22 3.59,32.47 5.61,32.43 7.13,31.52 7.96,31.36 12.82,31.37 14.2,31.37 14.76,31.49 15.65,32.08 16.66,32.31 17.28,31.99 17.74,31.26 17.37,30.36 15.19,29.65 15.19,28.98 15.19,28.31 16.12,27.39 17.52,26.24 v18.76,23.06
  Bottom 0.254: v2.86,33.76 3.34,32.9 3.77,32.47 D4.7 | v18.76,23.06 v18.8,19.13
PWM5  (via drill 0.5)
  Top 0.254: D1.14 22.6,7.53 22.82,6.63 23.28,5.58 23.47,5.07 23.38,4.42 22.71,3.75 22.1,3.64 21.04,3.58 20.35,3.59 19.62,3.12 19.14,2.62 18.65,2.56 18.21,2.77 17.86,3.49 17.95,4.82 17.88,6.29 17.71,6.74 17.42,6.87 16.61,6.89 12.97,6.88 7.58,6.89 v6.39,7.47
  Bottom 0.152: 3.14,11.63 3.49,11.5 5.77,11.5 5.96,11.44 6.08,11.08
  Bottom 0.203: 6.08,11.08 6.46,9.72 6.56,8.24
  Bottom 0.254: v6.39,7.47 6.56,8.24 | 3.14,11.63 3.19,13.42 3.16,14.14 2.69,14.44 1.85,15.18 1.78,15.52 1.81,16.38 2.47,17.67 3.47,19.59 3.5,22.79 3.36,23.78 3.05,24.27 3.12,26.47 3.2,27.27 3.21,28.31 3.64,28.66 D4.4
RESET  (via drill 0.5, 0.5 pad 0.25)
  Top 0.254: ICSP2.3 C1.1 32.11,3.65 32.1,5.25 31.74,6.41 v30.66,7.73 | v28.24,12.63 27.41,13.99 27.57,14.27
  Top 0.305: D1.29 27.57,14.76 27.57,14.27 27.57,14.2 v25.34,11.25
  Bottom 0.254: v30.66,7.73 30.39,8.11 29.81,8.93 29.75,9.97 29.66,10.81 28.93,11.55 v28.24,12.63
  Bottom 0.305: R21.1 v25.34,11.25
SCK_EN
  Top 0.254: D1.17 27.76,5.82 28.5,5.65 28.85,5.53 29.21,5.17 29.21,3.36 ICSP2.2
SCL  (via drill 0.5)
  Top 0.254: v27.24,27.85 27.75,26.34 v28.21,25.82 | v29.6,21.67 32.8,21.39 32.77,20.32 32.71,17.94 32.18,17.35 31.13,16.89 30.18,16.39 D1.28 | Q1.3 25.63,33.64 v24.95,31.24
  Bottom 0.254: v27.24,27.85 27,28.94 26.86,29.5 R2.1 v24.95,31.24 | v28.21,25.82 27.81,23.3 28.02,22.16 v29.6,21.67
SCL_3V
  Top 0.356: 24.92,38.82 25.53,38.76
  Top 0.406: JP2.3 23.9,38.87 24.92,38.82 | 25.53,38.76 26.07,38.52 Q1.2
  Bottom 0.203: U$6.P$24 23.05,38.99 JP2.3
SDA  (via drill 0.5)
  Top 0.254: v27.79,28.76 v28.44,26.8 | v30.34,22.36 33.15,22.03 33.26,21.7 33.27,19.67 33.22,18.81 33.21,17.68 32.57,16.99 31.12,16.38 30.51,16.02 29.93,15.04 D1.27 | Q2.3 v22.98,31.41
  Bottom 0.254: v27.79,28.76 27.67,29.89 27.52,30.91 26.91,32.43 26.85,33.06 25.64,33.05 24.28,32.97 R1.1 v22.98,31.41 | v28.44,26.8 28.98,26.13 29.09,25.17 28.61,24.5 28.33,23.84 28.28,23.37 28.33,22.99 28.58,22.74 v30.34,22.36
SDA_3V
  Top 0.406: Q2.2 21.97,37.85 21.02,37.15 20.07,37.78 JP2.2
  Bottom 0.203: U$6.P$28 25.02,38.74 24.95,38.86 24.64,38.99 24.13,39.43 24.13,40.7 23.68,41.15 23.37,41.34 21.46,41.34 JP2.2
UNUSED
  Top 0.305: D1.2 TP1.P$1
VBOOT1
  Bottom 0.254: C20.1 21.14,5.6 21.52,5.45 21.8,5.15 21.89,4.68 22.35,4.19 23.26,4.2 23.93,4.75 24.45,5.48 24.96,5.85 D6.2
  Bottom 0.406: D3.18 19.11,7.05 19.27,6.89 C20.1
VCC  (via drill 0.5, 0.5 pad 0.25)
  Top 0.305: R6.2 8.37,19.49
  Top 0.406: v16.33,14.46 16.79,15.38 16.79,19.37 16.79,20.01 | v2.73,35.02 5.09,34.96 7.83,33.95 14.84,33.93 v16.1,34.97 | Q3.3 C7.+ 15.94,20.01 16.79,20.01 | 16.79,20.01 19.74,20.01 20.19,20.3 20.16,22.44 19.1,25.17 C6.+ | C6.+ v15.93,28.89 | C6.+ v21.79,26.43
  Top 0.61: v2.59,15.75 3.07,16.77 4.68,17.16 5.83,17.85 6.41,18.42 7.11,19.21 8.37,19.49 Q3.1 Q3.2 Q3.3
  Bottom 0.406: D6.1 22.81,9.72 22.73,10.02 22.73,11.23 22.38,11.72 21.94,12.67 21.31,13.39 21.41,13.8 C25.1 D3.12 v16.33,14.46 | D4.12 v16.1,34.97 16.07,34.5 15.96,32.62 15.58,31.74 15.6,30.27 v15.93,28.89 | D4.9 v2.73,35.02 | V7.3 C4.2 C24.1 D5.1 23.03,26.83 22.49,26.66 v21.79,26.43
  Bottom 0.61: v2.59,15.75 3.13,14.97 D3.9
VCP1
  Bottom 0.406: C18.1 D6.3

### Text on the board
_tsilk: DTR | Gimbal | TX | Agouti | RX | ROLL | G | I | ch3 | - | 5 | P | G | ch2 | + | 5 | G | PITCH | ch1 | G | 5V | by Marc Griffith | Arduino Pro Compatible | RST | rchacker.com/products/gimbal | G
_bsilk: 3V3 | GND | based on the / original design / by Martinez | 5V | INT | SCL | SDA